# EAGLE design Stepper_module (EAGLE 7.2.0)
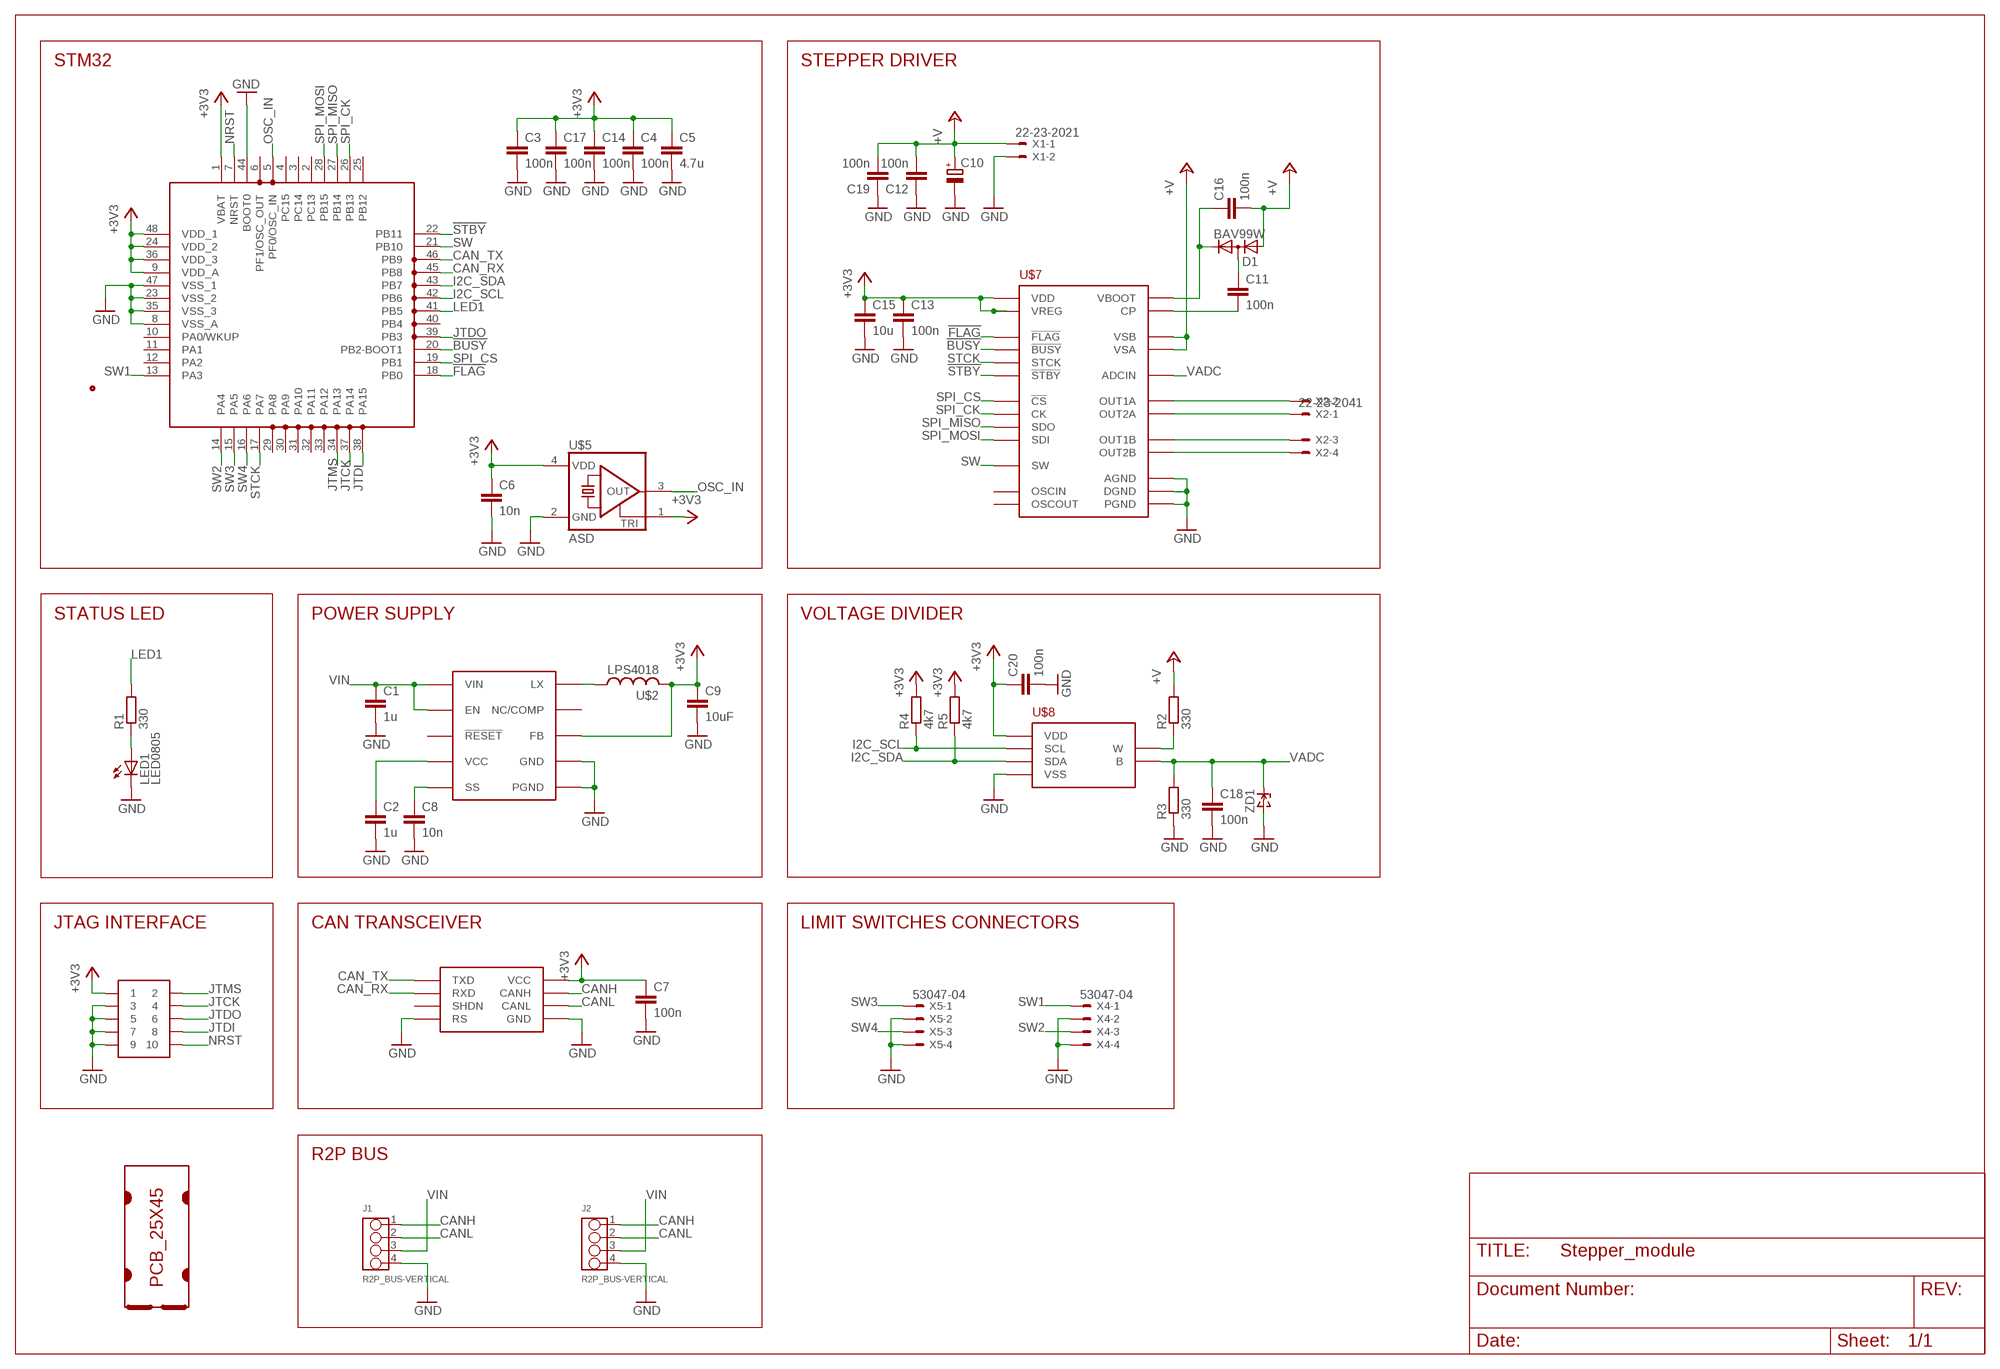
[diagram p0: schematic, sheet 1]

## Parts
C1  1u  C1206  [C1206]
C2  1u  C0603  [C0603]
C3  100n  C0603  [C0603]
C4  100n  C0603  [C0603]
C5  4.7u  C0805  [C0805]
C6  10n  C0603  [C0603]
C7  100n  C0603  [C0603]
C8  10n  C0603  [C0603]
C9  10uF  C0805  [C0805]
C10  CPOL-EUD  [PANASONIC_D]
C11  100n  C0603  [C0603]
C12  100n  C0603  [C0603]
C13  100n  C0603  [C0603]
C14  100n  C0603  [C0603]
C15  10u  C0805  [C0805]
C16  100n  C0603  [C0603]
C17  100n  C0603  [C0603]
C18  100n  C0603  [C0603]
C19  100n  C0603  [C0603]
C20  100n  C0603  [C0603]
D1  BAV99W  [SC70]
J1  R2P_BUS-VERTICAL  [OPL-EAGLE-LIBRARY_4P-2.0]
J2  R2P_BUS-VERTICAL  [OPL-EAGLE-LIBRARY_4P-2.0]
LED1  LED0805  [CHIPLED_0805]
R1  330  R0603  [R0603]
R2  330  R0603  [R0603]
R3  330  R0603  [R0603]
R4  4k7  R0603  [R0603]
R5  4k7  R0603  [R0603]
SOT1  MAX3051EKA  [SOT23-8L]
U$1  PCB_25X45  [25X45]
U$2  LPS4018  [LPS4018]
U$3  MAX17501  [TDFN-10]
U$4  JTAG-TH  [SAMTEC_FTSH-105-TH]
U$5  ASD  [2.5X2]
U$6  STM32F303C  [LQFP48]
U$7  L6470  [HTSSOP28]
U$8  MCP4017  [SC70-6L]
X1  22-23-2021  [22-23-2021]
X2  22-23-2041  [22-23-2041]
X4  53047-04  [53047-04]
X5  53047-04  [53047-04]
ZD1  ZENERSOD-323F  [SOD-323F]

## Nets
!BUSY: U$6.20(PB2-BOOT1) U$7.P$22(!BUSY)
!FLAG: U$6.18(PB0) U$7.P$24(!FLAG)
!STBY: U$6.22(PB11) U$7.P$3(!STBY)
+3V3: C3.1 C4.1 C5.1 C6.1 C7.1 C9.1 C13.1 C14.1 C15.1 C17.1 C20.1 R4.2 R5.2 SOT1.3(VCC) U$2.P$2 U$3.P$5(FB) U$4.1 U$5.1(TRI) U$5.4(VDD) U$6.1(VBAT) U$6.9(VDD_A) U$6.24(VDD_2) U$6.36(VDD_3) U$6.48(VDD_1) U$7.P$6(VREG) U$7.P$17(VDD) U$8.1(VDD)
+V: C10.+ C12.2 C16.2 C19.2 D1.1(A) R2.2 U$7.P$2(VSA) U$7.P$12(VSB) U$7.P$16(VSB) U$7.P$26(VSA) X1.1
CAN_RX: SOT1.4(RXD) U$6.45(PB8)
CAN_TX: SOT1.1(TXD) U$6.46(PB9)
CANH: J1.1 J2.1 SOT1.7(CANH)
CANL: J1.2 J2.2 SOT1.6(CANL)
GND: C1.2 C2.2 C3.2 C4.2 C5.2 C6.2 C7.2 C8.2 C9.2 C10.- C12.1 C13.2 C14.2 C15.2 C17.2 C18.2 C19.1 C20.2 J1.4 J2.4 LED1.C R3.1 SOT1.2(GND) SOT1.8(RS) U$3.P$1(PGND) U$3.P$9(GND) U$3.P$11(PGND) U$4.3 U$4.5 U$4.7 U$4.9 U$5.2(GND) U$6.8(VSS_A) U$6.23(VSS_2) U$6.35(VSS_3) U$6.44(BOOT0) U$6.47(VSS_1) U$7.P$9(AGND) U$7.P$13(PGND) U$7.P$21(DGND) U$7.P$27(PGND) U$7.P$29(PGND) U$8.2(VSS) X1.2 X4.2 X4.4 X5.2 X5.4 ZD1.A
I2C_SCL: R4.1 U$6.42(PB6) U$8.3(SCL)
I2C_SDA: R5.1 U$6.43(PB7) U$8.4(SDA)
JTCK: U$4.4 U$6.37(PA14)
JTDI: U$4.8 U$6.38(PA15)
JTDO: U$4.6 U$6.39(PB3)
JTMS: U$4.2 U$6.34(PA13)
LED1: R1.2 U$6.41(PB5)
N$1: U$2.P$1 U$3.P$10(LX)
N$3: U$7.P$28(OUT2A) X2.1
N$4: LED1.A R1.1
N$5: U$7.P$1(OUT1A) X2.2
N$6: U$7.P$14(OUT1B) X2.3
N$7: C2.1 U$3.P$4(VCC)
N$8: C8.1 U$3.P$6(SS)
N$9: U$7.P$15(OUT2B) X2.4
N$11: R2.1 U$8.6(W)
N$16: C11.1 D1.3(AC)
N$22: C11.2 U$7.P$10(CP)
N$23: C16.1 D1.2(C) U$7.P$11(VBOOT)
NRST: U$4.10 U$6.7(NRST)
OSC_IN: U$5.3(OUT) U$6.5(PF0/OSC_IN)
SPI_CK: U$6.26(PB13) U$7.P$19(CK)
SPI_CS: U$6.19(PB1) U$7.P$23(!CS)
SPI_MISO: U$6.27(PB14) U$7.P$18(SDO)
SPI_MOSI: U$6.28(PB15) U$7.P$20(SDI)
STCK: U$6.17(PA7) U$7.P$25(STCK)
SW: U$6.21(PB10) U$7.P$4(SW)
SW1: U$6.13(PA3) X4.1
SW2: U$6.14(PA4) X4.3
SW3: U$6.15(PA5) X5.1
SW4: U$6.16(PA6) X5.3
VADC: C18.1 R3.2 U$7.P$5(ADCIN) U$8.5(B) ZD1.C
VIN: C1.1 J1.3 J2.3 U$3.P$2(VIN) U$3.P$3(EN)
Unconnected: SOT1.5(SHDN) U$3.P$7(NC/COMP) U$3.P$8(!RESET) U$6.2(PC13) U$6.3(PC14) U$6.4(PC15) U$6.6(PF1/OSC_OUT) U$6.10(PA0/WKUP) U$6.11(PA1) U$6.12(PA2) U$6.25(PB12) U$6.29(PA8) U$6.30(PA9) U$6.31(PA10) U$6.32(PA11) U$6.33(PA12) U$6.40(PB4) U$7.P$7(OSCIN) U$7.P$8(OSCOUT)

## Notes on the sheet
- STM32 | STEPPER DRIVER
- STATUS LED | POWER SUPPLY | VOLTAGE DIVIDER
- JTAG INTERFACE | CAN TRANSCEIVER | LIMIT SWITCHES CONNECTORS
- R2P BUS

## Library data of the parts
C1-C9 C11-C20 = r2p_rcl:C
C10 = rcl:CPOL-EU: POLARIZED CAPACITOR, European symbol
D1 = nxp:BAV99
J1 J2 = r2p_connector:R2P_BUS
LED1 = r2p_led:LED
R1-R5 = r2p_rcl:R
SOT1 = r2p_ic:MAX3051
U$1 = r2p_pcb:PCB_25X45
U$2 = coilcraft:LPS4018
U$3 = r2p_ic:MAX17501
U$4 = r2p_connector:JTAG
U$5 = abracon:ASD
U$6 = st:STM32F303C
U$7 = st:L6470
U$8 = microchip:MCP4017
X1 = con-molex:22-23-2021: .100" (2.54mm) Center Header - 2 Pin; MF: MOLEX; MPN: 22-23-2021; OC_FARNELL: 1462926; OC_NEWARK: 25C3832
X2 = con-molex:22-23-2041: .100" (2.54mm) Center Header - 4 Pin; MF: MOLEX; MPN: 22-23-2041; OC_FARNELL: 1462920; OC_NEWARK: 38C0355
X4 X5 = con-molex:53?-04: CONNECTOR wire to board 1.25 mm (.049 inch) pitch header; MF: WALDOM/MOLEX; MPN: 53047-0410; OC_FARNELL: 9733060; OC_NEWARK: 38C9900
ZD1 = dp_devices:ZENER: Zener Diode SOD-323

## Board
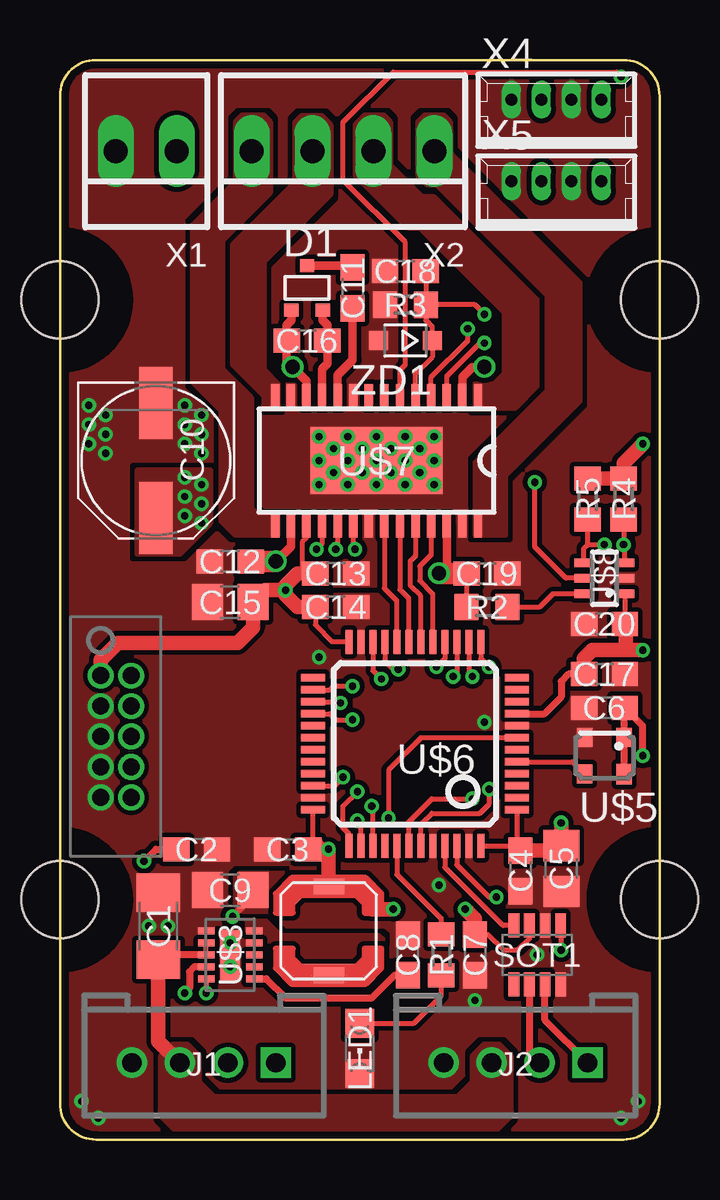
[diagram p1: board, top side]
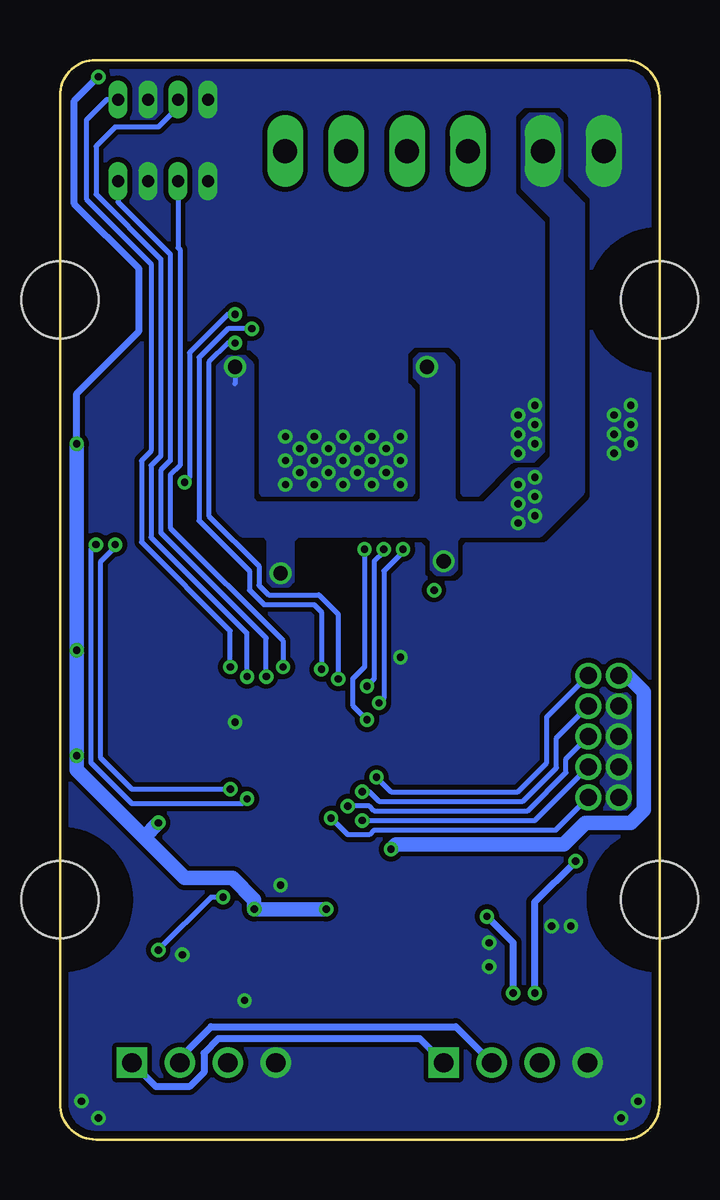
[diagram p2: board, bottom side, seen from below]

Size 25 x 45 mm. Coordinates in mm from the lower left corner, seen from the top.
Copper layers (1*16): Top 0.035mm / dielectric 1.5mm / Bottom 0.035mm
Design rules "2layer_0.2mm": minimum track width 0.2mm, minimum drill 0.3mm, track to track 0.2mm, track to pad 0.2mm, pad to pad 0.2mm, via to via 0.2mm, smd to smd 0mil, copper to edge 0.3mm, drill to drill 0.3mm, minimum pad ring 0.15mm, minimum via ring 0.15mm, stop-mask expansion 0.05mm, vias tented up to drill 2.5mm, thermal gap 0.25mm
tRestrict: 3 lines

### Footprints (pad centres in the part's own frame; a part is rotated, then mirrored left to right if it is on the bottom)
C1206 = smd 1.6 x 1.8: 1 -1.4,0; 2 1.4,0
C0603 = smd 1.1 x 1: 1 -0.85,0; 2 0.85,0
C0805 = smd 1.3 x 1.5: 1 -0.95,0; 2 0.95,0
PANASONIC_D = smd 3 x 1.4: + 2.4,0; - -2.4,0
SC70 = smd 0.6 x 0.55: 1 -0.65,-0.925; 2 0.65,-0.925; 3 0,0.925
OPL-EAGLE-LIBRARY_4P-2.0 = drill 0.8 pad 1.27 square: 1 -3,0 | drill 0.8 pad 1.27: 2 -1,0; 3 1,0; 4 3,0
CHIPLED_0805 = smd 1.2 x 1.2: A 0,-1.05; C 0,1.05
R0603 = smd 1 x 1.1: 1 -0.85,0; 2 0.85,0
SOT23-8L = smd 0.45 x 1: 1 -0.975,-1.225; 2 -0.325,-1.225; 3 0.325,-1.225; 4 0.975,-1.225; 5 0.975,1.225; 6 0.325,1.225; 7 -0.325,1.225; 8 -0.975,1.225
25X45 = hole 3.2: 0,10; 25,10; 0,35; 25,35
LPS4018 = smd 0.635 x 1.27: P$1 -1.85,0; P$2 1.85,0
TDFN-10 = smd 0.7 x 0.3: P$1 -1,1; P$2 -1,0.5; P$3 -1,0; P$4 -1,-0.5; P$5 -1,-1; P$6 1,-1; P$7 1,-0.5; P$8 1,0; P$9 1,0.5; P$10 1,1 | smd 0.8 x 2.08: P$11 0,0
SAMTEC_FTSH-105-TH = drill 0.711 pad 1.016: 1 -2.54,0; 2 -2.54,1.27; 3 -1.27,0; 4 -1.27,1.27; 5 0,0; 6 0,1.27; 7 1.27,0; 8 1.27,1.27; 9 2.54,0; 10 2.54,1.27
2.5X2 = smd 0.65 x 0.8: 1 -0.825,-0.762; 2 0.825,-0.762; 3 0.825,0.762 | smd 0.65 x 0.85: 4 -0.825,0.762
LQFP48 = smd 1 x 0.3: 1 -4.25,2.75; 2 -4.25,2.25; 3 -4.25,1.75; 4 -4.25,1.25; 5 -4.25,0.75; 6 -4.25,0.25; 7 -4.25,-0.25; 8 -4.25,-0.75; 9 -4.25,-1.25; 10 -4.25,-1.75; 11 -4.25,-2.25; 12 -4.25,-2.75; 25 4.25,-2.75; 26 4.25,-2.25; 27 4.25,-1.75; 28 4.25,-1.25; 29 4.25,-0.75; 30 4.25,-0.25; 31 4.25,0.25; 32 4.25,0.75; 33 4.25,1.25; 34 4.25,1.75; 35 4.25,2.25; 36 4.25,2.75 | smd 0.3 x 1: 13 -2.75,-4.25; 14 -2.25,-4.25; 15 -1.75,-4.25; 16 -1.25,-4.25; 17 -0.75,-4.25; 18 -0.25,-4.25; 19 0.25,-4.25; 20 0.75,-4.25; 21 1.25,-4.25; 22 1.75,-4.25; 23 2.25,-4.25; 24 2.75,-4.25; 37 2.75,4.25; 38 2.25,4.25; 39 1.75,4.25; 40 1.25,4.25; 41 0.75,4.25; 42 0.25,4.25; 43 -0.25,4.25; 44 -0.75,4.25; 45 -1.25,4.25; 46 -1.75,4.25; 47 -2.25,4.25; 48 -2.75,4.25
HTSSOP28 = smd 1 x 0.35: P$1 -2.7,4.225; P$2 -2.7,3.575; P$3 -2.7,2.925; P$4 -2.7,2.275; P$5 -2.7,1.625; P$6 -2.7,0.975; P$7 -2.7,0.325; P$8 -2.7,-0.325; P$9 -2.7,-0.975; P$10 -2.7,-1.625; P$11 -2.7,-2.275; P$12 -2.7,-2.925; P$13 -2.7,-3.575; P$14 -2.7,-4.225; P$15 2.7,-4.225; P$16 2.7,-3.575; P$17 2.7,-2.925; P$18 2.7,-2.275; P$19 2.7,-1.625; P$20 2.7,-0.975; P$21 2.7,-0.325; P$22 2.7,0.325; P$23 2.7,0.975; P$24 2.7,1.625; P$25 2.7,2.275; P$26 2.7,2.925; P$27 2.7,3.575; P$28 2.7,4.225 | smd 2.8 x 5.5: P$29 0,0
SC70-6L = smd 0.35 x 0.8: 1 -0.65,-0.85; 2 0,-0.85; 3 0.65,-0.85; 4 0.65,0.85; 5 0,0.85; 6 -0.65,0.85
22-23-2021 = drill 1 long: 1 -1.27,0; 2 1.27,0
22-23-2041 = drill 1 long: 1 -3.81,0; 2 -1.27,0; 3 1.27,0; 4 3.81,0
53047-04 = drill 0.5 pad 0.698 long: 1 1.875,0.45; 2 0.625,0.45; 3 -0.625,0.45; 4 -1.875,0.45
SOD-323F = smd 0.8 x 0.8: A 1.125,0; C -1.125,0

### Placement (x,y rotation side)
C1  4.1,8.9 90 top
C2  5.7,12.1 0 top
C3  9.5,12.1 180 top
C4  19.2,11.2 270 top
C5  20.9,11.3 270 top
C6  22.7,18 180 top
C7  17.3,7.7 270 top
C8  14.5,7.7 90 top
C9  7.1,10.4 180 top
C10  4,28.3 270 top
C11  12.2,35.5 270 top
C12  7.1,24.1 0 top
C13  11.5,23.6 0 top
C14  11.5,22.2 0 top
C15  7.1,22.4 180 top
C16  10.3,33.3 180 top
C17  22.7,19.4 0 top
C18  14.4,36.2 180 top
C19  17.8,23.6 180 top
C20  22.7,21.5 180 top
D1  10.3,35.5 0 top
J1  6,3.2 180 top
J2  19,3.2 180 top
LED1  12.5,3.8 180 top
R1  15.9,7.7 90 top
R2  17.8,22.2 180 top
R3  14.4,34.8 0 top
R4  23.5,26.7 90 top
R5  22,26.7 90 top
SOT1  19.9,7.7 180 top
U$1  0,0 0 top
U$2  11.2,8.7 90 top
U$3  7.1,7.7 0 top
U$4  1.7,16.8 270 top
U$5  22.7,16 180 top
U$6  14.8,16.5 180 top
U$7  13.2,28.3 270 top
U$8  22.7,23.4 90 top
X1  3.6,41.2 180 top
X2  11.8,41.2 180 top
X4  20.7,42.9 0 top
X5  20.7,39.5 0 top
ZD1  14.4,33.3 180 top

### Tracks (layer width: path | path; a pad name or v marks a point on that pad's centre or on a via)
!BUSY
  Top 0.2: U$7.P$22 13.53,22.98 14.05,22.45 U$6.20
!FLAG
  Top 0.2: U$7.P$24 14.82,24.32 14.6,24.1 14.6,23.1 15.05,22.65 U$6.18
!STBY  (via drill 0.3)
  Top 0.2: U$7.P$3 16.12,31.82 17.5,33.2 v17.7,33.2 | U$6.22 13.05,19.55 v13.4,19.2
  Bottom 0.2: v17.7,33.2 18,33.2 18.8,32.4 18.8,26 16.7,23.9 16.7,23.1 16.3,22.7 14.2,22.7 13.4,21.9 v13.4,19.2
+3V3  (via drill 0.3)
  Top 0.2: U$3.P$5 v6.1,6.1 | C7.1 17.85,8.55 18.5,7.9 19.1,7.9 19.57,8.38 SOT1.3 | C3.1 10.55,12.3 U$6.36 | 19,12.25 C4.1 | U$6.1 19.05,12.2 C4.1 | U$6.48 19.2,12.25 C4.1 | C14.1 10.65,21.45 11.35,20.75 U$6.24 | U$7.P$17 10.28,25.07 10.1,24.9 10.1,23.6 | U$7.P$6 14.18,32.08 14.4,32.3 14.4,37.4 11.8,40 11.8,42.4 13.9,44.5 23.2,44.5 v23.4,44.3 | U$8.1 C20.1
  Top 0.3: 8.05,10.55 8.05,10.75 7.95,10.75 | U$6.9 20.2,17.75 20.9,18.45 20.9,19.1 21.2,19.4 C17.1 | v24.3,16 24.3,17.25 C6.1 23.52,17.98 U$5.1 U$5.4 | v7.2,9.3 8.05,10.15 C9.1
  Top 0.6: U$2.P$2 v11.2,12.1 C3.1 | 10.55,12.3 10.7,12.3 | C4.1 20.7,12.05 C5.1 v20.9,13.2 | C7.1 17.3,9.2 v16.9,9.6 | 21.8,19.45 C17.1 21.85,20.05 22.2,20.4 23.59,20.4 | v13.9,9.6 13,9.6 | C14.1 9.9,22.2 9.4,22.7 v9.4,22.9 | C13.1 10.1,23.6 9.9,23.6 9.4,23.1 v9.4,22.9 | v9.4,22.9 8.55,22.9 C15.1 8.05,21.35 7.4,20.7 2.4,20.7 1.7,20 U$4.1 | 23.59,20.4 v24.3,20.4 | 23.59,20.4 23.59,21.46 C20.1 | R5.2 R4.2 23.5,28.2 v24.3,29
  Bottom 0.3: v6.1,6.1 6.1,8.2 v7.2,9.3 | v24.3,29 24.3,31.1 21.7,33.7 21.7,36.3 24.4,39 24.4,43.3 v23.4,44.3
  Bottom 0.6: 21.5,12.6 19.8,10.9 17.8,10.9 16.9,10 v16.9,9.6 v13.9,9.6 | v20.9,13.2 21.5,12.6 | 21.5,12.6 24.3,15.4 v24.3,16 v24.3,20.4 v24.3,29 | v11.2,12.1 11,12.3 4,12.3 3.1,13.2 1.2,13.2 0.65,13.75 0.65,18.65 1.34,19.34 U$4.1
  pour Top (rank 5, no thermals): 13.3,8.9 13.5,9.1 13.5,10.3 12.8,11 9.5,11 9.4,11.1 7.5,11.1 7.3,10.9 7.3,9.8 8.3,8.9
+V  (via drill 0.3, 0.6)
  Top 0.2: 9.65,32.25 v9.7,32.2 | C19.2 R2.2
  Top 0.35: U$7.P$12 10.28,31.62 v9.7,32.2 9.45,32.45 C16.2 9.45,33.95 9.65,34.15 D1.1 | U$7.P$16 9.62,24.73 v9,24.1 | U$7.P$2 16.77,31.77 17.2,32.2 v17.7,32.2 | U$7.P$26 16.12,23.93 v15.8,23.6
  Top 0.9: C12.2 v9,24.1 | C19.2 v15.8,23.6
  Bottom 0.2: v17.7,32.2 17.7,31.5
  other vias: 5.9,25.7 5.9,26.5 5.2,27.6 5.2,26.8 5.2,26 5.9,27.3
  pour Top (no thermals): 3.2,27.9 3.2,24.4 5,24.4 6.3,25.7 6.3,27.9
  pour Bottom (no thermals): 17.3,32.6 18,32.6 18.4,32.2 18.4,26.2 17.4,25.2 16.5,25.2 16.3,25 16.3,23.3 16.1,23.1 15.5,23.1 15.3,23.3 15.3,25 15.1,25.2 9.7,25.2 9.5,25 9.5,23.8 9.3,23.6 8.7,23.6 8.5,23.8 8.5,25 8.3,25.2 5,25.2 3.2,27 3.2,39 4.1,39.9 4.1,42.4 4.4,42.7 5.4,42.7 5.7,42.4 5.7,39.7 4.5,38.5 4.5,28.4 5,27.9 5.9,27.9 7.3,26.5 8.4,26.5 8.6,26.7 8.6,32.3 9,32.7 10,32.7 10.2,32.5 10.2,31.8 9.9,31.5 9.9,26.7 10.1,26.5 16.8,26.5 17,26.7 17,32.3
CAN_RX
  Top 0.2: U$6.45 16.05,11.35 18.4,9 18.48,8.93 SOT1.4
CAN_TX  (via drill 0.3)
  Top 0.2: U$6.46 16.55,11.45 17.9,10.1 v18.2,10.1 | SOT1.1 20.88,7.92 v20.9,7.9
  Bottom 0.2: v18.2,10.1 18.7,10.1 v20.9,7.9
CANH
  Top 0.3: J2.1 20.23,4.97 SOT1.7
  Bottom 0.3: J1.1 10,4.2 18.4,4.2 19,3.6 19,2.8 19.6,2.2 21,2.2 J2.1
CANL
  Top 0.3: 19.57,3.62 J2.2 19.57,3.62 | SOT1.6 19.57,3.62
  Bottom 0.3: J1.2 8.5,4.7 18.7,4.7 20,3.4 J2.2
GND  (via drill 0.3)
  other vias: 7.1,8.2 7.1,7.2 4.5,8.9 3.7,8.9 17.3,5.8 19.9,7.7 24.1,1.6 23.4,0.9 1.6,0.9 0.9,1.6 17.7,17.4 15.8,10.6 13.2,28.3 10.8,29.3 10.8,28.3 10.8,27.3 11.4,27.8 11.4,28.8 12,29.3 12.6,28.8 12,28.3 12,27.3 12.6,27.8 13.2,27.3 13.2,29.3 13.8,28.8 13.8,27.8 14.4,28.3 14.4,29.3 14.4,27.3 15,27.8 15,28.8 15.6,29.3 15.6,28.3 15.6,27.3 5.9,28.6 5.9,29.4 5.9,30.2 5.2,30.6 5.2,29.8 5.2,29 1.9,28.6 1.9,29.4 1.9,30.2 1.2,30.6 1.2,29.8 1.2,29 10.8,20.1
  pour Bottom (rank 6, no thermals): 0,0 25,0 25,45 0,45
  pour Top (rank 6, no thermals): 0,0 25,0 25,45 0,45
I2C_SCL  (via drill 0.3)
  Top 0.2: R4.1 v23.5,24.8 23.55,24.75 U$8.3 | U$6.42 14.55,13.25 15.5,14.2 v17.2,14.2
  Bottom 0.2: v17.2,14.2 17.4,14 22,14 23.7,15.7 23.7,24.6 v23.5,24.8
I2C_SDA  (via drill 0.3)
  Top 0.2: U$8.4 21.85,24.65 22,24.8 | 22,24.8 R5.1 | 22,24.8 v22.7,24.8 | U$6.43 15.05,13.15 15.5,13.6 17.5,13.6 17.9,14 v17.9,14.6
  Bottom 0.2: v17.9,14.6 22,14.6 23.3,15.9 23.3,24.1 22.7,24.7 v22.7,24.8
JTCK  (via drill 0.3)
  Top 0.2: U$6.37 12.05,12.75 11.8,13 11.8,13.9 v12.4,14.5
  Bottom 0.2: v12.4,14.5 12.1,14.5 11.7,14.1 5.7,14.1 4.3,15.5 4.3,16.74 U$4.4
JTDI  (via drill 0.3)
  Top 0.2: U$6.38 12.55,13.15 v12.4,13.3
  Bottom 0.2: v12.4,13.3 5.2,13.3 U$4.8
JTDO  (via drill 0.3)
  Top 0.2: U$6.39 13.05,13.85 v13,13.9
  Bottom 0.2: v13,13.9 12.1,13.9 11.9,13.7 5.5,13.7 3.9,15.3 3.9,15.87 U$4.6
JTMS  (via drill 0.3)
  Top 0.2: U$6.34 11.45,14.75 v11.8,15.1
  Bottom 0.2: v11.8,15.1 11.2,14.5 5.9,14.5 4.7,15.7 4.7,17.61 U$4.2
LED1
  Top 0.2: R1.2 15.9,9.2 14.05,11.05 U$6.41
N$1
  pour Top (no thermals): 7.8,8.7 8.2,8.7 8.5,8.2 8.5,7.5 9.6,6.4 12.8,6.4 13.5,7.1 13.5,8.3 13.3,8.5 9.2,8.5 8.6,9.1 7.8,9.1
N$3
  pour Top (no thermals): 15.2,42.7 14.9,42.4 14.9,40.2 15.3,39.8 15.7,39.8 20.3,35.2 20.3,31.2 17.3,28.2 17.3,25.2 18.6,25.2 18.6,27.7 21.7,30.8 21.7,35.7 16.3,41.1 16.3,42.4 16,42.7
N$4
  Top 0.2: LED1.A 14.75,4.85 15.9,6 R1.1
N$5
  pour Top (no thermals): 12.7,42.7 12.3,42.3 12.3,40.2 14.5,38 15,38 18.5,34.5 18.5,31.9 18.1,31.5 17.3,31.5 17.3,30.5 19,30.5 19.9,31.4 19.9,35 15.6,39.3 15.1,39.3 13.8,40.6 13.8,42.4 13.5,42.7
N$6
  pour Top (no thermals): 10.9,42.7 11.3,42.3 11.3,39.4 8.5,36.6 8.5,32.1 9.1,31.5 9.1,30.5 8.5,30.5 8.5,31 7.2,32.3 7.2,37.3 9.8,39.9 9.8,42.4 10.1,42.7
N$7  (via drill 0.3)
  Top 0.3: U$3.P$4 5.6,7.2 5.4,7 5.4,6.3 v5.2,6.1 | v3.5,11.6 4,12.1 C2.1
  Bottom 0.3: v5.2,6.1 5.2,9.9 v3.5,11.6
N$8
  Top 0.3: U$3.P$6 8.6,6.7 9.4,5.9 13,5.9 13.95,6.85 C8.1
N$9
  pour Top (no thermals): 8.5,42.7 7.6,42.7 7.3,42.4 7.3,39.9 5.5,38.1 5.5,31.6 6.7,30.4 6.7,25.8 7.3,25.2 9.1,25.2 9.1,26 8.3,26 8,26.3 8,30.9 6.8,32.1 6.8,37.5 8.8,39.5 8.8,42.4
N$11
  Top 0.2: R2.1 20,22.2 20.55,22.75 U$8.6
N$16
  Top 0.35: D1.3 12.12,36.42 C11.1
N$22
  Top 0.35: C11.2 12.2,32.5 11.57,31.88 U$7.P$10
N$23
  Top 0.35: U$7.P$11 10.93,32.12 11.15,32.35 C16.1 11.15,33.95 10.95,34.15 D1.2
NRST  (via drill 0.3)
  Top 0.2: U$6.7 15.05,16.75 13.7,15.4 v13.7,13.4
  Bottom 0.2: v13.7,13.4 13,12.7 12.7,12.7 12.1,12.7 11.9,12.9 4.33,12.9 U$4.10
OSC_IN
  Top 0.2: U$6.5 21.36,15.75 U$5.3
SPI_CK  (via drill 0.3)
  Top 0.2: U$7.P$19 11.57,24.68 v11.5,24.6 | U$6.26 11.25,18.75 11.4,18.9 v12.2,18.9
  Bottom 0.2: v11.5,24.6 11.5,24.5 11.9,24.1 11.9,19.2 v12.2,18.9
SPI_CS
  Top 0.2: U$7.P$23 14.18,22.93 14.55,22.55 U$6.19
SPI_MISO  (via drill 0.3)
  Top 0.2: U$7.P$18 10.93,24.82 v10.7,24.6 | U$6.27 11.65,18.25 v11.7,18.2
  Bottom 0.2: v10.7,24.6 10.7,24.5 11.5,23.7 11.5,18.4 v11.7,18.2
SPI_MOSI  (via drill 0.3)
  Top 0.2: U$7.P$20 12.22,24.68 v12.3,24.6 | U$6.28 11.25,17.75 11.5,17.5 v12.2,17.5
  Bottom 0.2: v12.3,24.6 12.3,19.7 12.8,19.2 12.8,18.1 v12.2,17.5
STCK
  Top 0.2: U$7.P$25 15.47,24.38 15,23.9 15,23.3 15.55,22.75 U$6.17
SW  (via drill 0.3)
  Top 0.2: U$7.P$4 15.47,31.77 17,33.3 v17,33.8 | U$6.21 13.55,19.95 13.9,19.6 v14.1,19.6
  Bottom 0.2: v17,33.8 18,33.8 19.2,32.6 19.2,25.8 17.1,23.7 17.1,22.9 16.5,22.3 14.4,22.3 14.1,22 v14.1,19.6
SW1  (via drill 0.3)
  Top 0.2: U$6.13 17.55,20.05 v17.9,19.7
  Bottom 0.2: X4.1 23.05,43.35 23.9,42.5 23.9,39.2 21.2,36.5 21.2,28.7 21.6,28.3 21.6,24.9 17.9,21.2 v17.9,19.7
SW2  (via drill 0.3)
  Top 0.2: U$6.14 17.05,19.45 v17.2,19.3
  Bottom 0.2: X4.3 20.07,43.02 20.9,42.2 22.7,42.2 23.5,41.4 23.5,39.4 20.8,36.7 20.8,28.5 21.2,28.1 21.2,25.1 17.2,21.1 v17.2,19.3
SW3  (via drill 0.3)
  Top 0.2: U$6.15 16.55,19.45 v16.4,19.3
  Bottom 0.2: X5.1 22.57,39.08 20.4,36.9 20.4,28.3 20.8,27.9 20.8,25.3 16.4,20.9 v16.4,19.3
SW4  (via drill 0.3)
  Top 0.2: U$6.16 16.05,20.05 v15.7,19.7
  Bottom 0.2: X5.3 20.07,37.17 20,37.1 20,28.1 20.4,27.7 20.4,25.5 15.7,20.8 v15.7,19.7
VADC  (via drill 0.3)
  Top 0.2: R3.2 15.25,34.15 15.53,33.88 ZD1.C 15.53,32.62 14.82,31.93 U$7.P$5 | C18.1 R3.2 | v17.7,34.4 17.3,34.8 R3.2 | U$8.5 21.1,23.4 19.8,24.7 v19.8,27.4
  Bottom 0.2: v17.7,34.4 18,34.4 19.6,32.8 19.6,27.6 v19.8,27.4
VIN
  Top 0.2: U$3.P$3 U$3.P$2
  Top 0.3: U$3.P$3 4.3,7.7 C1.1
  Top 0.6: C1.1 4.1,4.1 J1.3
  pour Top (no thermals): 4.7,4 5.3,4 5.8,3.5 5.8,2.4 6.4,1.8 16.6,1.8 17.2,2.4 17.2,3.5 17.7,4 18.3,4 18.8,3.5 18.8,1 17.8,0 5.2,0 4.2,1 4.2,3.5

### Text on the board
200bmp: Stepper module / v1.0 (2015/02)